# EAGLE schematic combo (EAGLE 9.6.2)
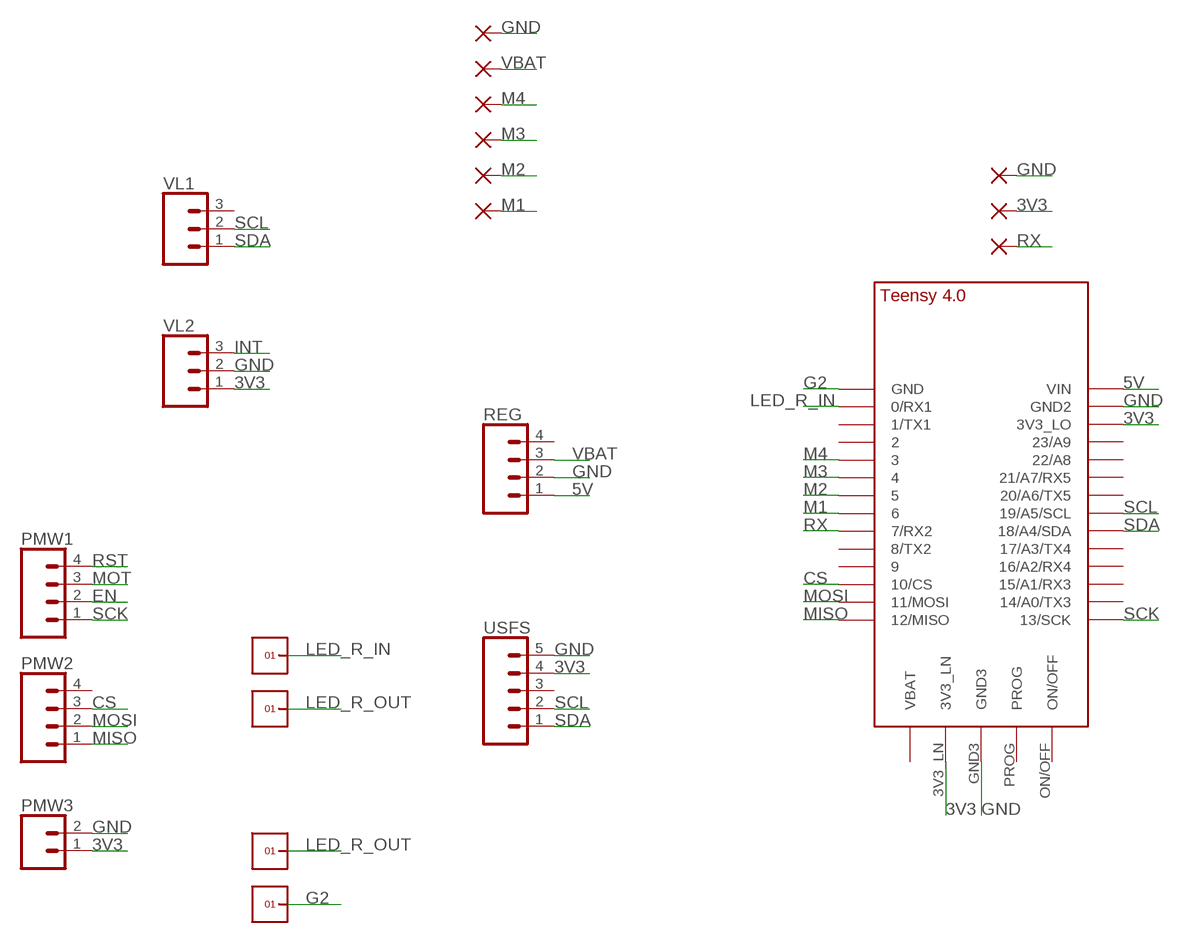
[diagram p0: schematic, sheet 1]

## Parts
3V  SMD2  [SMD1,27-2,54]
GD  SMD2  [SMD1,27-2,54]
GND  SMD2  [SMD1,27-2,54]
M1  SMD2  [SMD1,27-2,54]
M2  SMD2  [SMD1,27-2,54]
M3  SMD2  [SMD1,27-2,54]
M4  SMD2  [SMD1,27-2,54]
PMW1  CONN_041X04_NO_SILK  [1X04_NO_SILK]
PMW2  CONN_041X04_NO_SILK  [1X04_NO_SILK]
PMW3  CONN_021X02_NO_SILK  [1X02_NO_SILK]
REG  CONN_041X04_NO_SILK  [1X04_NO_SILK]
RX  SMD2  [SMD1,27-2,54]
U$1  TEENSY_4.0  [TEENSY_4.0]
U$3  1X1  [1X1]
U$4  1X1  [1X1]
U$6  1X1  [1X1]
U$7  1X1  [1X1]
USFS  CONN_05NO_SILK  [1X05_NO_SILK]
VBAT  SMD2  [SMD1,27-2,54]
VL1  CONN_031X03_NO_SILK  [1X03_NO_SILK]
VL2  CONN_031X03_NO_SILK  [1X03_NO_SILK]

## Nets
3V3: 3V.1(P) PMW3.1 U$1.3V3_LN U$1.3V3_LO USFS.4 VL2.1
5V: REG.1 U$1.VIN
CS: PMW2.3 U$1.10/CS
EN: PMW1.2
G2: U$1.GND U$7.1
GND: GD.1(P) GND.1(P) PMW3.2 REG.2 U$1.GND2 U$1.GND3 USFS.5 VL2.2
INT: VL2.3
LED_R_IN: U$1.0/RX(0/RX1) U$3.1
LED_R_OUT: U$4.1 U$6.1
M1: M1.1(P) U$1.6
M2: M2.1(P) U$1.5
M3: M3.1(P) U$1.4/CANRX
M4: M4.1(P) U$1.3/CANTX
MISO: PMW2.1 U$1.12/MISO
MOSI: PMW2.2 U$1.11/MOSI
MOT: PMW1.3
RST: PMW1.4
RX: RX.1(P) U$1.7(7/RX2)
SCK: PMW1.1 U$1.13/SCK
SCL: U$1.19/A5/SCL USFS.2 VL1.2
SDA: U$1.18/A4/SDA USFS.1 VL1.1
VBAT: REG.3 VBAT.1(P)
Unconnected: PMW2.4 REG.4 U$1.1/TX(1/TX1) U$1.2 U$1.8(8/TX2) U$1.9/CS U$1.14/A0(14/A0/TX3) U$1.15/A1(15/A1/RX3) U$1.16/A2(16/A2/RX4) U$1.17/A3(17/A3/TX4) U$1.20/A6(20/A6/TX5) U$1.21/A7(21/A7/RX5) U$1.22/A8 U$1.23/A9 U$1.ON/OFF U$1.PROG U$1.VBAT\(VBAT) USFS.3 VL1.3

## Library data of the parts
3V GD GND M1-M4 RX VBAT = wirepad:SMD2: SMD PAD
PMW1 PMW2 REG = SparkFun-Connectors:CONN_04: Multi connection point. Often used as Generic Header-pin footprint for 0.1 inch spaced/style header connections On any of the 0.1 inch spaced packages, you can populate with these: Break Away Headers - Straight <https://www.sparkfun.com/products/116> (PRT-00116) Break Away Male Headers - Right Angle <https://www.sparkfun.com/products/553> (PRT-00553) Female Headers <https://www.sparkfun.com/products/115> (PRT-00115) Break Away Headers - Machine Pin <https://www.sparkfun.com/products/117> (PRT-00117) Break Away Female Headers - Swiss Machine Pin <https://www.sparkfun.com/products/743> (PRT-00743) For SCREWTERMINALS and SPRING TERMINALS visit here: Screw Terimnals on SparkFun.com <https://www.sparkfun.com/search/results?term=Screw+Terminals> (5mm/3.5mm/2.54mm spacing) This device is also useful as a general connection point to wire up your design to another part of your project. Our various solder wires solder well into these plated through hole pads. Hook-Up Wire - Assortment (Stranded, 22 AWG) <https://www.sparkfun.com/products/11375> (PRT-11375) Hook-Up Wire - Assortment (Solid Core, 22 AWG) <https://www.sparkfun.com/products/11367> (PRT-11367) View the entire wire category on our website here <https://www.sparkfun.com/categories/141> Special notes: Molex polarized connector foot print use with SKU : PRT-08231 with associated crimp pins and housings. 1MM SMD Version SKU: PRT-10208; PROD_ID: CONN-09696
PMW3 = SparkFun-Connectors:CONN_02: Multi connection point. Often used as Generic Header-pin footprint for 0.1 inch spaced/style header connections On any of the 0.1 inch spaced packages, you can populate with these: Break Away Headers - Straight <https://www.sparkfun.com/products/116> (PRT-00116) Break Away Male Headers - Right Angle <https://www.sparkfun.com/products/553> (PRT-00553) Female Headers <https://www.sparkfun.com/products/115> (PRT-00115) Break Away Headers - Machine Pin <https://www.sparkfun.com/products/117> (PRT-00117) Break Away Female Headers - Swiss Machine Pin <https://www.sparkfun.com/products/743> (PRT-00743) For SCREWTERMINALS and SPRING TERMINALS visit here: Screw Terimnals on SparkFun.com <https://www.sparkfun.com/search/results?term=Screw+Terminals> (5mm/3.5mm/2.54mm spacing) This device is also useful as a general connection point to wire up your design to another part of your project. Our various solder wires solder well into these plated through hole pads. Hook-Up Wire - Assortment (Stranded, 22 AWG) <https://www.sparkfun.com/products/11375> (PRT-11375) Hook-Up Wire - Assortment (Solid Core, 22 AWG) <https://www.sparkfun.com/products/11367> (PRT-11367) View the entire wire category on our website here <https://www.sparkfun.com/categories/141> Special notes: Molex polarized connector foot print use with: PRT-08233 with associated crimp pins and housings. 2.54_SCREWTERM for use with PRT-10571. 3.5mm Screw Terminal footprints for PRT-08084 5mm Screw Terminal footprints for use with PRT-08432
U$1 = TEENSY 4.0:TEENSY_4.0
U$3 U$4 U$6 U$7 = headers(2mm):1X1
USFS = SparkFun-Connectors:CONN_05: Multi connection point. Often used as Generic Header-pin footprint for 0.1 inch spaced/style header connections On any of the 0.1 inch spaced packages, you can populate with these: Break Away Headers - Straight <https://www.sparkfun.com/products/116> (PRT-00116) Break Away Male Headers - Right Angle <https://www.sparkfun.com/products/553> (PRT-00553) Female Headers <https://www.sparkfun.com/products/115> (PRT-00115) Break Away Headers - Machine Pin <https://www.sparkfun.com/products/117> (PRT-00117) Break Away Female Headers - Swiss Machine Pin <https://www.sparkfun.com/products/743> (PRT-00743) For SCREWTERMINALS and SPRING TERMINALS visit here: Screw Terimnals on SparkFun.com <https://www.sparkfun.com/search/results?term=Screw+Terminals> (5mm/3.5mm/2.54mm spacing) This device is also useful as a general connection point to wire up your design to another part of your project. Our various solder wires solder well into these plated through hole pads. Hook-Up Wire - Assortment (Stranded, 22 AWG) <https://www.sparkfun.com/products/11375> (PRT-11375) Hook-Up Wire - Assortment (Solid Core, 22 AWG) <https://www.sparkfun.com/products/11367> (PRT-11367) View the entire wire category on our website here <https://www.sparkfun.com/categories/141> Special notes: Molex polarized connector foot print use with SKU : PRT-08231 with associated crimp pins and housings. 1MM SMD Version SKU: PRT-10208
VL1 VL2 = SparkFun-Connectors:CONN_03: Multi connection point. Often used as Generic Header-pin footprint for 0.1 inch spaced/style header connections On any of the 0.1 inch spaced packages, you can populate with these: Break Away Headers - Straight <https://www.sparkfun.com/products/116> (PRT-00116) Break Away Male Headers - Right Angle <https://www.sparkfun.com/products/553> (PRT-00553) Female Headers <https://www.sparkfun.com/products/115> (PRT-00115) Break Away Headers - Machine Pin <https://www.sparkfun.com/products/117> (PRT-00117) Break Away Female Headers - Swiss Machine Pin <https://www.sparkfun.com/products/743> (PRT-00743) Stackable Header - 3 Pin (Female, 0.1") <https://www.sparkfun.com/products/13875> (PRT-13875) For SCREWTERMINALS and SPRING TERMINALS visit here: Screw Terimnals on SparkFun.com <https://www.sparkfun.com/search/results?term=Screw+Terminals> (5mm/3.5mm/2.54mm spacing) This device is also useful as a general connection point to wire up your design to another part of your project. Our various solder wires solder well into these plated through hole pads. Hook-Up Wire - Assortment (Stranded, 22 AWG) <https://www.sparkfun.com/products/11375> (PRT-11375) Hook-Up Wire - Assortment (Solid Core, 22 AWG) <https://www.sparkfun.com/products/11367> (PRT-11367) View the entire wire category on our website here <https://www.sparkfun.com/categories/141> Special notes: Molex polarized connector foot print use with SKU : PRT-08232 with associated crimp pins and housings.